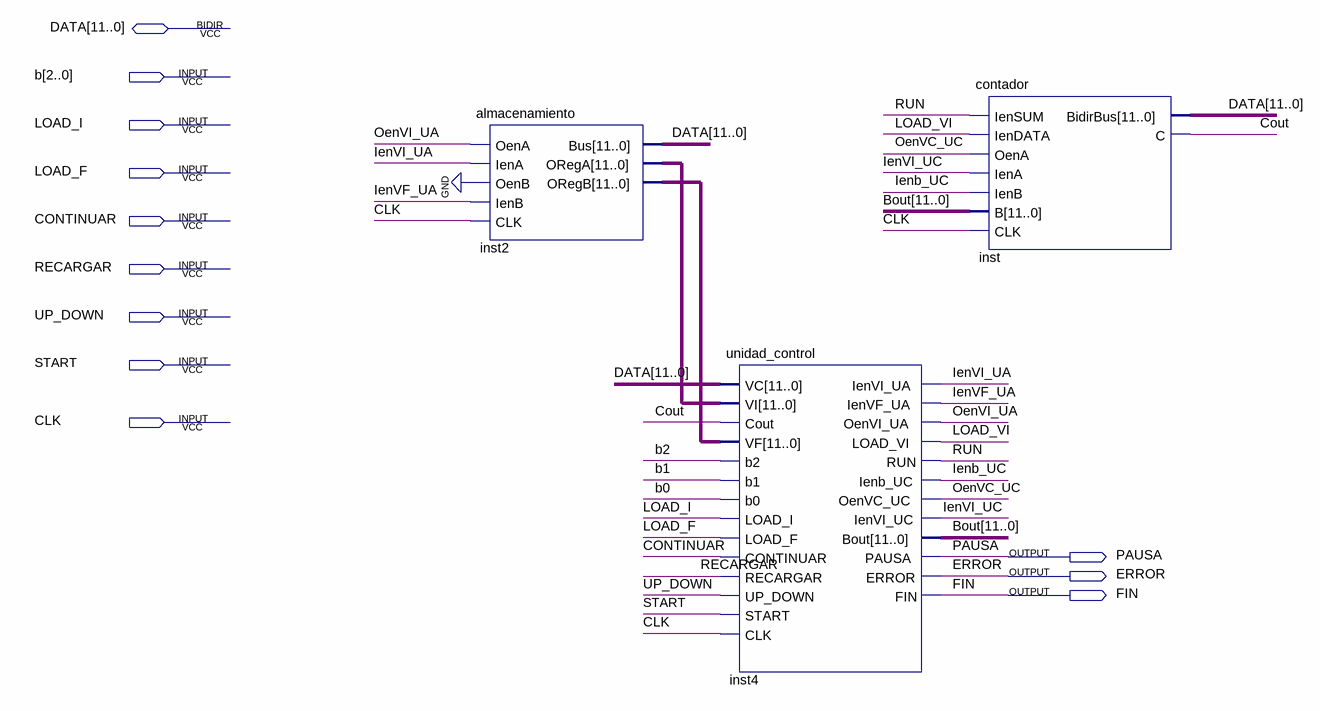
[diagram p0: schematic sheet]
// Quartus schematic circuito_principal.bdf as structural Verilog: 3 symbols, 12 pins
module circuito_principal (
  input  [2:0] b,
  input  LOAD_I,
  input  LOAD_F,
  input  CONTINUAR,
  input  RECARGAR,
  input  UP_DOWN,
  input  START,
  input  CLK,
  inout  [11:0] DATA,
  output PAUSA,
  output ERROR,
  output FIN
);

  wire Cout, Ienb_UC, IenVF_UA, IenVI_UA, IenVI_UC, LOAD_VI, OenVC_UC, OenVI_UA, RUN;
  wire [11:0] Bout, inst2_orega, inst2_oregb;

  almacenamiento inst2 (
    .OenA(OenVI_UA), .IenA(IenVI_UA), .OenB(1'b0), .IenB(IenVF_UA), .CLK(CLK), .ORegA(inst2_orega),
    .ORegB(inst2_oregb), .Bus(DATA));
  unidad_control inst4 (
    .VC(DATA), .VI(inst2_orega), .Cout(Cout), .VF(inst2_oregb), .b2(b[2]), .b1(b[1]), .b0(b[0]),
    .LOAD_I(LOAD_I), .LOAD_F(LOAD_F), .CONTINUAR(CONTINUAR), .RECARGAR(RECARGAR), .UP_DOWN(UP_DOWN),
    .START(START), .CLK(CLK), .IenVI_UA(IenVI_UA), .IenVF_UA(IenVF_UA), .OenVI_UA(OenVI_UA),
    .LOAD_VI(LOAD_VI), .RUN(RUN), .Ienb_UC(Ienb_UC), .OenVC_UC(OenVC_UC), .IenVI_UC(IenVI_UC), .Bout(Bout),
    .PAUSA(PAUSA), .ERROR(ERROR), .FIN(FIN));
  contador inst (
    .IenSUM(RUN), .IenDATA(LOAD_VI), .OenA(OenVC_UC), .IenA(IenVI_UC), .IenB(Ienb_UC), .B(Bout), .CLK(CLK),
    .C(Cout), .BidirBus(DATA));
endmodule
